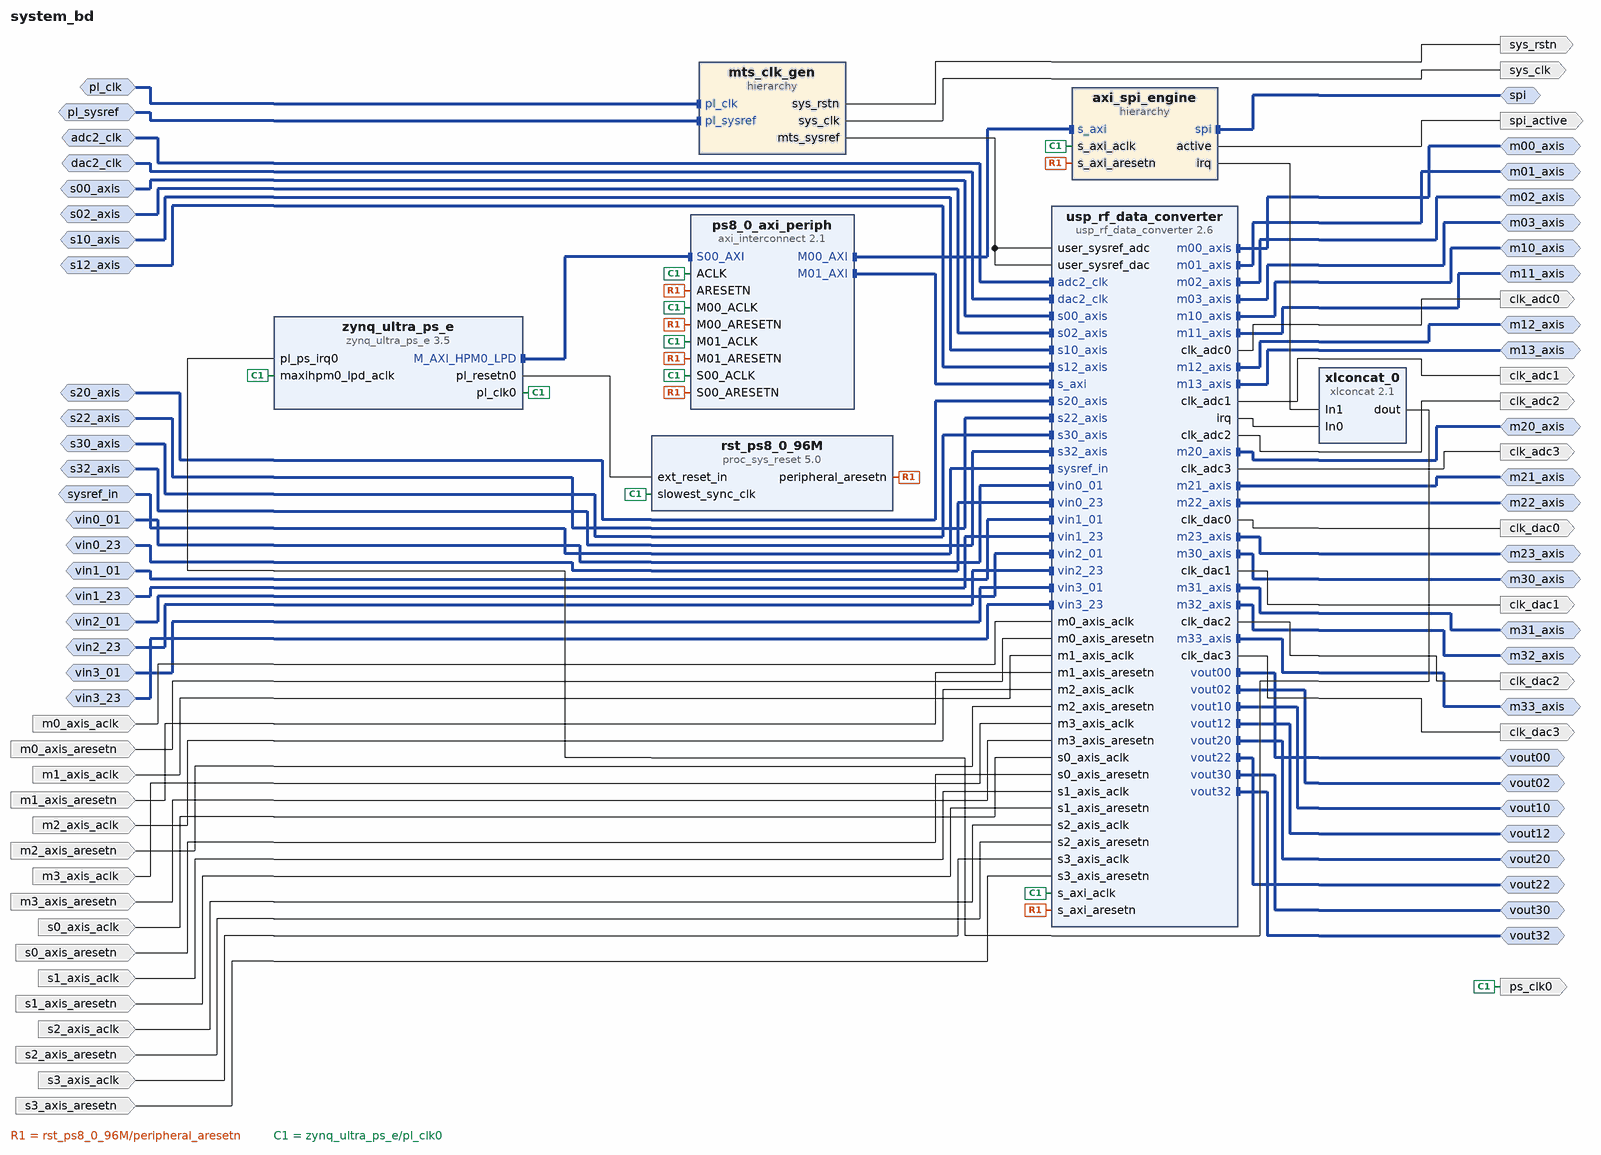
[diagram p0: block diagram of the top level]
# Vivado block design system_bd, xczu47dr-ffve1156-2-i, Vivado 2024.1
create_bd_design system_bd

create_bd_intf_port -mode Master -vlnv analog.com:interface:spi_engine_rtl:1.0 spi
create_bd_intf_port -mode Slave -vlnv xilinx.com:interface:diff_clock_rtl:1.0 pl_clk
set_property -dict {CONFIG.FREQ_HZ 245760000} [get_bd_intf_ports pl_clk]
create_bd_intf_port -mode Slave -vlnv xilinx.com:interface:diff_clock_rtl:1.0 pl_sysref
create_bd_intf_port -mode Slave -vlnv xilinx.com:interface:diff_clock_rtl:1.0 adc2_clk
create_bd_intf_port -mode Slave -vlnv xilinx.com:interface:diff_clock_rtl:1.0 dac2_clk
create_bd_intf_port -mode Master -vlnv xilinx.com:interface:axis_rtl:1.0 m00_axis
create_bd_intf_port -mode Master -vlnv xilinx.com:interface:axis_rtl:1.0 m01_axis
create_bd_intf_port -mode Master -vlnv xilinx.com:interface:axis_rtl:1.0 m02_axis
create_bd_intf_port -mode Master -vlnv xilinx.com:interface:axis_rtl:1.0 m03_axis
create_bd_intf_port -mode Master -vlnv xilinx.com:interface:axis_rtl:1.0 m10_axis
create_bd_intf_port -mode Master -vlnv xilinx.com:interface:axis_rtl:1.0 m11_axis
create_bd_intf_port -mode Master -vlnv xilinx.com:interface:axis_rtl:1.0 m12_axis
create_bd_intf_port -mode Master -vlnv xilinx.com:interface:axis_rtl:1.0 m13_axis
create_bd_intf_port -mode Master -vlnv xilinx.com:interface:axis_rtl:1.0 m20_axis
create_bd_intf_port -mode Master -vlnv xilinx.com:interface:axis_rtl:1.0 m21_axis
create_bd_intf_port -mode Master -vlnv xilinx.com:interface:axis_rtl:1.0 m22_axis
create_bd_intf_port -mode Master -vlnv xilinx.com:interface:axis_rtl:1.0 m23_axis
create_bd_intf_port -mode Master -vlnv xilinx.com:interface:axis_rtl:1.0 m30_axis
create_bd_intf_port -mode Master -vlnv xilinx.com:interface:axis_rtl:1.0 m31_axis
create_bd_intf_port -mode Master -vlnv xilinx.com:interface:axis_rtl:1.0 m32_axis
create_bd_intf_port -mode Master -vlnv xilinx.com:interface:axis_rtl:1.0 m33_axis
create_bd_intf_port -mode Slave -vlnv xilinx.com:interface:axis_rtl:1.0 s00_axis
set_property -dict [list \
  CONFIG.HAS_TKEEP 0 \
  CONFIG.HAS_TLAST 0 \
  CONFIG.HAS_TREADY 1 \
  CONFIG.HAS_TSTRB 0 \
  CONFIG.LAYERED_METADATA undef \
  CONFIG.TDATA_NUM_BYTES 4 \
  CONFIG.TDEST_WIDTH 0 \
  CONFIG.TID_WIDTH 0 \
  CONFIG.TUSER_WIDTH 0 \
] [get_bd_intf_ports s00_axis]
create_bd_intf_port -mode Slave -vlnv xilinx.com:interface:axis_rtl:1.0 s02_axis
set_property -dict [list \
  CONFIG.HAS_TKEEP 0 \
  CONFIG.HAS_TLAST 0 \
  CONFIG.HAS_TREADY 1 \
  CONFIG.HAS_TSTRB 0 \
  CONFIG.LAYERED_METADATA undef \
  CONFIG.TDATA_NUM_BYTES 4 \
  CONFIG.TDEST_WIDTH 0 \
  CONFIG.TID_WIDTH 0 \
  CONFIG.TUSER_WIDTH 0 \
] [get_bd_intf_ports s02_axis]
create_bd_intf_port -mode Slave -vlnv xilinx.com:interface:axis_rtl:1.0 s10_axis
set_property -dict [list \
  CONFIG.HAS_TKEEP 0 \
  CONFIG.HAS_TLAST 0 \
  CONFIG.HAS_TREADY 1 \
  CONFIG.HAS_TSTRB 0 \
  CONFIG.LAYERED_METADATA undef \
  CONFIG.TDATA_NUM_BYTES 4 \
  CONFIG.TDEST_WIDTH 0 \
  CONFIG.TID_WIDTH 0 \
  CONFIG.TUSER_WIDTH 0 \
] [get_bd_intf_ports s10_axis]
create_bd_intf_port -mode Slave -vlnv xilinx.com:interface:axis_rtl:1.0 s12_axis
set_property -dict [list \
  CONFIG.HAS_TKEEP 0 \
  CONFIG.HAS_TLAST 0 \
  CONFIG.HAS_TREADY 1 \
  CONFIG.HAS_TSTRB 0 \
  CONFIG.LAYERED_METADATA undef \
  CONFIG.TDATA_NUM_BYTES 4 \
  CONFIG.TDEST_WIDTH 0 \
  CONFIG.TID_WIDTH 0 \
  CONFIG.TUSER_WIDTH 0 \
] [get_bd_intf_ports s12_axis]
create_bd_intf_port -mode Slave -vlnv xilinx.com:interface:axis_rtl:1.0 s20_axis
set_property -dict [list \
  CONFIG.HAS_TKEEP 0 \
  CONFIG.HAS_TLAST 0 \
  CONFIG.HAS_TREADY 1 \
  CONFIG.HAS_TSTRB 0 \
  CONFIG.LAYERED_METADATA undef \
  CONFIG.TDATA_NUM_BYTES 4 \
  CONFIG.TDEST_WIDTH 0 \
  CONFIG.TID_WIDTH 0 \
  CONFIG.TUSER_WIDTH 0 \
] [get_bd_intf_ports s20_axis]
create_bd_intf_port -mode Slave -vlnv xilinx.com:interface:axis_rtl:1.0 s22_axis
set_property -dict [list \
  CONFIG.HAS_TKEEP 0 \
  CONFIG.HAS_TLAST 0 \
  CONFIG.HAS_TREADY 1 \
  CONFIG.HAS_TSTRB 0 \
  CONFIG.LAYERED_METADATA undef \
  CONFIG.TDATA_NUM_BYTES 4 \
  CONFIG.TDEST_WIDTH 0 \
  CONFIG.TID_WIDTH 0 \
  CONFIG.TUSER_WIDTH 0 \
] [get_bd_intf_ports s22_axis]
create_bd_intf_port -mode Slave -vlnv xilinx.com:interface:axis_rtl:1.0 s30_axis
set_property -dict [list \
  CONFIG.HAS_TKEEP 0 \
  CONFIG.HAS_TLAST 0 \
  CONFIG.HAS_TREADY 1 \
  CONFIG.HAS_TSTRB 0 \
  CONFIG.LAYERED_METADATA undef \
  CONFIG.TDATA_NUM_BYTES 4 \
  CONFIG.TDEST_WIDTH 0 \
  CONFIG.TID_WIDTH 0 \
  CONFIG.TUSER_WIDTH 0 \
] [get_bd_intf_ports s30_axis]
create_bd_intf_port -mode Slave -vlnv xilinx.com:interface:axis_rtl:1.0 s32_axis
set_property -dict [list \
  CONFIG.HAS_TKEEP 0 \
  CONFIG.HAS_TLAST 0 \
  CONFIG.HAS_TREADY 1 \
  CONFIG.HAS_TSTRB 0 \
  CONFIG.LAYERED_METADATA undef \
  CONFIG.TDATA_NUM_BYTES 4 \
  CONFIG.TDEST_WIDTH 0 \
  CONFIG.TID_WIDTH 0 \
  CONFIG.TUSER_WIDTH 0 \
] [get_bd_intf_ports s32_axis]
create_bd_intf_port -mode Slave -vlnv xilinx.com:display_usp_rf_data_converter:diff_pins_rtl:1.0 sysref_in
create_bd_intf_port -mode Slave -vlnv xilinx.com:interface:diff_analog_io_rtl:1.0 vin0_01
create_bd_intf_port -mode Slave -vlnv xilinx.com:interface:diff_analog_io_rtl:1.0 vin0_23
create_bd_intf_port -mode Slave -vlnv xilinx.com:interface:diff_analog_io_rtl:1.0 vin1_01
create_bd_intf_port -mode Slave -vlnv xilinx.com:interface:diff_analog_io_rtl:1.0 vin1_23
create_bd_intf_port -mode Slave -vlnv xilinx.com:interface:diff_analog_io_rtl:1.0 vin2_01
create_bd_intf_port -mode Slave -vlnv xilinx.com:interface:diff_analog_io_rtl:1.0 vin2_23
create_bd_intf_port -mode Slave -vlnv xilinx.com:interface:diff_analog_io_rtl:1.0 vin3_01
create_bd_intf_port -mode Slave -vlnv xilinx.com:interface:diff_analog_io_rtl:1.0 vin3_23
create_bd_intf_port -mode Master -vlnv xilinx.com:interface:diff_analog_io_rtl:1.0 vout00
create_bd_intf_port -mode Master -vlnv xilinx.com:interface:diff_analog_io_rtl:1.0 vout02
create_bd_intf_port -mode Master -vlnv xilinx.com:interface:diff_analog_io_rtl:1.0 vout10
create_bd_intf_port -mode Master -vlnv xilinx.com:interface:diff_analog_io_rtl:1.0 vout12
create_bd_intf_port -mode Master -vlnv xilinx.com:interface:diff_analog_io_rtl:1.0 vout20
create_bd_intf_port -mode Master -vlnv xilinx.com:interface:diff_analog_io_rtl:1.0 vout22
create_bd_intf_port -mode Master -vlnv xilinx.com:interface:diff_analog_io_rtl:1.0 vout30
create_bd_intf_port -mode Master -vlnv xilinx.com:interface:diff_analog_io_rtl:1.0 vout32
create_bd_port -dir O spi_active
create_bd_port -dir O -type clk sys_rstn
create_bd_port -dir O sys_clk
create_bd_port -dir O -type clk ps_clk0
create_bd_port -dir O -type clk clk_adc0
create_bd_port -dir O -type clk clk_adc1
create_bd_port -dir O -type clk clk_adc2
create_bd_port -dir O -type clk clk_adc3
create_bd_port -dir O -type clk clk_dac0
create_bd_port -dir O -type clk clk_dac1
create_bd_port -dir O -type clk clk_dac2
create_bd_port -dir O -type clk clk_dac3
create_bd_port -dir I -type clk m0_axis_aclk
set_property -dict {CONFIG.ASSOCIATED_RESET m0_axis_aresetn} [get_bd_ports m0_axis_aclk]
create_bd_port -dir I -type rst m0_axis_aresetn
create_bd_port -dir I -type clk m1_axis_aclk
set_property -dict {CONFIG.ASSOCIATED_RESET m1_axis_aresetn} [get_bd_ports m1_axis_aclk]
create_bd_port -dir I -type rst m1_axis_aresetn
create_bd_port -dir I -type clk m2_axis_aclk
set_property -dict {CONFIG.ASSOCIATED_RESET m2_axis_aresetn} [get_bd_ports m2_axis_aclk]
create_bd_port -dir I -type rst m2_axis_aresetn
create_bd_port -dir I -type clk m3_axis_aclk
set_property -dict {CONFIG.ASSOCIATED_RESET m3_axis_aresetn} [get_bd_ports m3_axis_aclk]
create_bd_port -dir I -type rst m3_axis_aresetn
create_bd_port -dir I -type clk s0_axis_aclk
set_property -dict {CONFIG.ASSOCIATED_RESET s0_axis_aresetn} [get_bd_ports s0_axis_aclk]
create_bd_port -dir I -type rst s0_axis_aresetn
create_bd_port -dir I -type clk s1_axis_aclk
set_property -dict {CONFIG.ASSOCIATED_RESET s1_axis_aresetn} [get_bd_ports s1_axis_aclk]
create_bd_port -dir I -type rst s1_axis_aresetn
create_bd_port -dir I -type clk s2_axis_aclk
set_property -dict {CONFIG.ASSOCIATED_RESET s2_axis_aresetn} [get_bd_ports s2_axis_aclk]
create_bd_port -dir I -type rst s2_axis_aresetn
create_bd_port -dir I -type clk s3_axis_aclk
set_property -dict {CONFIG.ASSOCIATED_RESET s3_axis_aresetn} [get_bd_ports s3_axis_aclk]
create_bd_port -dir I -type rst s3_axis_aresetn

create_bd_cell -type ip -vlnv xilinx.com:ip:usp_rf_data_converter:2.6 usp_rf_data_converter
set_property -dict [list \
  CONFIG.ADC0_Clock_Source 2 \
  CONFIG.ADC0_Multi_Tile_Sync true \
  CONFIG.ADC0_PLL_Enable false \
  CONFIG.ADC0_Refclk_Freq 4915.200 \
  CONFIG.ADC0_Sampling_Rate 4.9152 \
  CONFIG.ADC1_Clock_Dist 0 \
  CONFIG.ADC1_Clock_Source 2 \
  CONFIG.ADC1_Multi_Tile_Sync true \
  CONFIG.ADC1_PLL_Enable false \
  CONFIG.ADC1_Refclk_Freq 4915.200 \
  CONFIG.ADC2_Clock_Dist 1 \
  CONFIG.ADC2_Clock_Source 2 \
  CONFIG.ADC2_Multi_Tile_Sync true \
  CONFIG.ADC2_PLL_Enable false \
  CONFIG.ADC2_Refclk_Freq 4915.200 \
  CONFIG.ADC3_Clock_Source 2 \
  CONFIG.ADC3_Multi_Tile_Sync true \
  CONFIG.ADC3_PLL_Enable false \
  CONFIG.ADC3_Refclk_Freq 4915.200 \
  CONFIG.ADC_Data_Type00 1 \
  CONFIG.ADC_Data_Type02 1 \
  CONFIG.ADC_Data_Type12 1 \
  CONFIG.ADC_Data_Type22 1 \
  CONFIG.ADC_Data_Type32 1 \
  CONFIG.ADC_Data_Width00 1 \
  CONFIG.ADC_Data_Width02 1 \
  CONFIG.ADC_Data_Width10 1 \
  CONFIG.ADC_Data_Width12 1 \
  CONFIG.ADC_Data_Width20 1 \
  CONFIG.ADC_Data_Width22 1 \
  CONFIG.ADC_Data_Width30 1 \
  CONFIG.ADC_Data_Width32 1 \
  CONFIG.ADC_Decimation_Mode00 20 \
  CONFIG.ADC_Decimation_Mode02 20 \
  CONFIG.ADC_Decimation_Mode10 20 \
  CONFIG.ADC_Decimation_Mode12 20 \
  CONFIG.ADC_Decimation_Mode20 20 \
  CONFIG.ADC_Decimation_Mode22 20 \
  CONFIG.ADC_Decimation_Mode30 20 \
  CONFIG.ADC_Decimation_Mode32 20 \
  CONFIG.ADC_Mixer_Type00 2 \
  CONFIG.ADC_Mixer_Type02 2 \
  CONFIG.ADC_Mixer_Type10 2 \
  CONFIG.ADC_Mixer_Type12 2 \
  CONFIG.ADC_Mixer_Type20 2 \
  CONFIG.ADC_Mixer_Type22 2 \
  CONFIG.ADC_Mixer_Type30 2 \
  CONFIG.ADC_Mixer_Type32 2 \
  CONFIG.ADC_Slice02_Enable true \
  CONFIG.ADC_Slice10_Enable true \
  CONFIG.ADC_Slice12_Enable true \
  CONFIG.ADC_Slice20_Enable true \
  CONFIG.ADC_Slice22_Enable true \
  CONFIG.ADC_Slice30_Enable true \
  CONFIG.ADC_Slice32_Enable true \
  CONFIG.DAC0_Clock_Dist 0 \
  CONFIG.DAC0_Clock_Source 6 \
  CONFIG.DAC0_Multi_Tile_Sync true \
  CONFIG.DAC0_PLL_Enable false \
  CONFIG.DAC0_Refclk_Freq 4915.200 \
  CONFIG.DAC1_Multi_Tile_Sync true \
  CONFIG.DAC1_PLL_Enable false \
  CONFIG.DAC1_Refclk_Freq 4915.200 \
  CONFIG.DAC2_Clock_Dist 1 \
  CONFIG.DAC2_Clock_Source 6 \
  CONFIG.DAC2_Multi_Tile_Sync true \
  CONFIG.DAC2_PLL_Enable false \
  CONFIG.DAC2_Refclk_Freq 4915.200 \
  CONFIG.DAC3_Multi_Tile_Sync true \
  CONFIG.DAC3_PLL_Enable false \
  CONFIG.DAC3_Refclk_Freq 4915.200 \
  CONFIG.DAC_Data_Width00 2 \
  CONFIG.DAC_Data_Width02 2 \
  CONFIG.DAC_Data_Width10 2 \
  CONFIG.DAC_Data_Width12 2 \
  CONFIG.DAC_Data_Width20 2 \
  CONFIG.DAC_Data_Width22 2 \
  CONFIG.DAC_Data_Width30 2 \
  CONFIG.DAC_Data_Width32 2 \
  CONFIG.DAC_Interpolation_Mode00 20 \
  CONFIG.DAC_Interpolation_Mode02 20 \
  CONFIG.DAC_Interpolation_Mode10 20 \
  CONFIG.DAC_Interpolation_Mode12 20 \
  CONFIG.DAC_Interpolation_Mode20 20 \
  CONFIG.DAC_Interpolation_Mode22 20 \
  CONFIG.DAC_Interpolation_Mode30 20 \
  CONFIG.DAC_Interpolation_Mode32 20 \
  CONFIG.DAC_Mixer_Type00 2 \
  CONFIG.DAC_Mixer_Type02 2 \
  CONFIG.DAC_Mixer_Type10 2 \
  CONFIG.DAC_Mixer_Type12 2 \
  CONFIG.DAC_Mixer_Type20 2 \
  CONFIG.DAC_Mixer_Type22 2 \
  CONFIG.DAC_Mixer_Type30 2 \
  CONFIG.DAC_Mixer_Type32 2 \
  CONFIG.DAC_Slice00_Enable true \
  CONFIG.DAC_Slice02_Enable true \
  CONFIG.DAC_Slice10_Enable true \
  CONFIG.DAC_Slice12_Enable true \
  CONFIG.DAC_Slice20_Enable true \
  CONFIG.DAC_Slice22_Enable true \
  CONFIG.DAC_Slice30_Enable true \
  CONFIG.DAC_Slice32_Enable true \
] [get_bd_cells usp_rf_data_converter]
create_bd_cell -type hier axi_spi_engine
create_bd_cell -type ip -vlnv xilinx.com:ip:axi_interconnect:2.1 ps8_0_axi_periph
set_property -dict {CONFIG.NUM_MI 2} [get_bd_cells ps8_0_axi_periph]
create_bd_cell -type ip -vlnv xilinx.com:ip:proc_sys_reset:5.0 rst_ps8_0_96M
create_bd_cell -type hier mts_clk_gen
create_bd_cell -type ip -vlnv xilinx.com:ip:xlconcat:2.1 xlconcat_0
create_bd_cell -type ip -vlnv xilinx.com:ip:zynq_ultra_ps_e:3.5 zynq_ultra_ps_e
set_property -dict [list \
  CONFIG.PSU_BANK_0_IO_STANDARD LVCMOS18 \
  CONFIG.PSU_BANK_1_IO_STANDARD LVCMOS18 \
  CONFIG.PSU_BANK_2_IO_STANDARD LVCMOS18 \
  CONFIG.PSU_BANK_3_IO_STANDARD LVCMOS18 \
  CONFIG.PSU_DYNAMIC_DDR_CONFIG_EN 1 \
  CONFIG.PSU__CRF_APB__DDR_CTRL__FREQMHZ 1067 \
  CONFIG.PSU__CSUPMU__PERIPHERAL__VALID 1 \
  CONFIG.PSU__DDRC__COMPONENTS UDIMM \
  CONFIG.PSU__DDRC__DEVICE_CAPACITY {8192 MBits} \
  CONFIG.PSU__DDRC__DRAM_WIDTH {16 Bits} \
  CONFIG.PSU__DDRC__SPEED_BIN DDR4_2400P \
  CONFIG.PSU__DDR_HIGH_ADDRESS_GUI_ENABLE 1 \
  CONFIG.PSU__DDR__INTERFACE__FREQMHZ 533.500 \
  CONFIG.PSU__ENET3__FIFO__ENABLE 0 \
  CONFIG.PSU__ENET3__GRP_MDIO__ENABLE 1 \
  CONFIG.PSU__ENET3__GRP_MDIO__IO {MIO 76 .. 77} \
  CONFIG.PSU__ENET3__PERIPHERAL__ENABLE 1 \
  CONFIG.PSU__ENET3__PERIPHERAL__IO {MIO 64 .. 75} \
  CONFIG.PSU__ENET3__PTP__ENABLE 0 \
  CONFIG.PSU__ENET3__TSU__ENABLE 0 \
  CONFIG.PSU__GEM3_COHERENCY 0 \
  CONFIG.PSU__GEM3_ROUTE_THROUGH_FPD 0 \
  CONFIG.PSU__GEM__TSU__ENABLE 0 \
  CONFIG.PSU__I2C0__PERIPHERAL__ENABLE 1 \
  CONFIG.PSU__I2C0__PERIPHERAL__IO {MIO 14 .. 15} \
  CONFIG.PSU__I2C1__PERIPHERAL__ENABLE 1 \
  CONFIG.PSU__I2C1__PERIPHERAL__IO {MIO 16 .. 17} \
  CONFIG.PSU__PMU_COHERENCY 0 \
  CONFIG.PSU__PMU__AIBACK__ENABLE 0 \
  CONFIG.PSU__PMU__EMIO_GPI__ENABLE 0 \
  CONFIG.PSU__PMU__EMIO_GPO__ENABLE 0 \
  CONFIG.PSU__PMU__GPI0__ENABLE 1 \
  CONFIG.PSU__PMU__GPI0__IO {MIO 26} \
  CONFIG.PSU__PMU__GPI1__ENABLE 0 \
  CONFIG.PSU__PMU__GPI2__ENABLE 0 \
  CONFIG.PSU__PMU__GPI3__ENABLE 0 \
  CONFIG.PSU__PMU__GPI4__ENABLE 0 \
  CONFIG.PSU__PMU__GPI5__ENABLE 0 \
  CONFIG.PSU__PMU__GPO0__ENABLE 0 \
  CONFIG.PSU__PMU__GPO1__ENABLE 0 \
  CONFIG.PSU__PMU__GPO2__ENABLE 0 \
  CONFIG.PSU__PMU__GPO3__ENABLE 0 \
  CONFIG.PSU__PMU__GPO4__ENABLE 0 \
  CONFIG.PSU__PMU__GPO5__ENABLE 0 \
  CONFIG.PSU__PMU__PERIPHERAL__ENABLE 1 \
  CONFIG.PSU__PMU__PLERROR__ENABLE 0 \
  CONFIG.PSU__QSPI_COHERENCY 0 \
  CONFIG.PSU__QSPI_ROUTE_THROUGH_FPD 0 \
  CONFIG.PSU__QSPI__GRP_FBCLK__ENABLE 0 \
  CONFIG.PSU__QSPI__PERIPHERAL__DATA_MODE x4 \
  CONFIG.PSU__QSPI__PERIPHERAL__ENABLE 1 \
  CONFIG.PSU__QSPI__PERIPHERAL__IO {MIO 0 .. 12} \
  CONFIG.PSU__QSPI__PERIPHERAL__MODE {Dual Parallel} \
  CONFIG.PSU__TSU__BUFG_PORT_PAIR 0 \
  CONFIG.PSU__TTC0__CLOCK__ENABLE 0 \
  CONFIG.PSU__TTC0__PERIPHERAL__ENABLE 1 \
  CONFIG.PSU__TTC0__WAVEOUT__ENABLE 0 \
  CONFIG.PSU__TTC1__CLOCK__ENABLE 0 \
  CONFIG.PSU__TTC1__PERIPHERAL__ENABLE 1 \
  CONFIG.PSU__TTC1__WAVEOUT__ENABLE 0 \
  CONFIG.PSU__TTC2__CLOCK__ENABLE 0 \
  CONFIG.PSU__TTC2__PERIPHERAL__ENABLE 1 \
  CONFIG.PSU__TTC2__WAVEOUT__ENABLE 0 \
  CONFIG.PSU__TTC3__CLOCK__ENABLE 0 \
  CONFIG.PSU__TTC3__PERIPHERAL__ENABLE 1 \
  CONFIG.PSU__TTC3__WAVEOUT__ENABLE 0 \
  CONFIG.PSU__UART0__BAUD_RATE 115200 \
  CONFIG.PSU__UART0__MODEM__ENABLE 0 \
  CONFIG.PSU__UART0__PERIPHERAL__ENABLE 1 \
  CONFIG.PSU__UART0__PERIPHERAL__IO {MIO 18 .. 19} \
  CONFIG.PSU__USE__IRQ0 1 \
] [get_bd_cells zynq_ultra_ps_e]
# 57 more settings of zynq_ultra_ps_e are not shown: defaults, MIO pin electricals, DDR timing, and values the tool derives

# ---- hierarchy /axi_spi_engine ----
current_bd_instance /axi_spi_engine
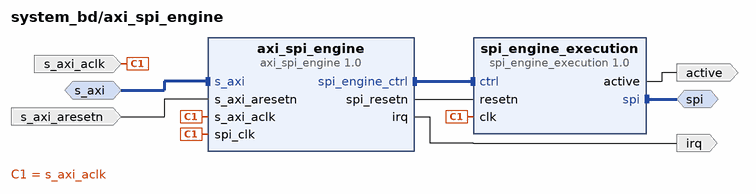
[diagram p1: block diagram inside /axi_spi_engine]
create_bd_intf_pin -mode Slave -vlnv xilinx.com:interface:aximm_rtl:1.0 s_axi
create_bd_intf_pin -mode Master -vlnv analog.com:interface:spi_engine_rtl:1.0 spi
create_bd_pin -dir I -type clk s_axi_aclk
create_bd_pin -dir I -type rst s_axi_aresetn
create_bd_pin -dir O active
create_bd_pin -dir O irq

create_bd_cell -type ip -vlnv analog.com:user:axi_spi_engine:1.0 axi_spi_engine
set_property -dict {CONFIG.NUM_OF_SDI 1} [get_bd_cells axi_spi_engine]
create_bd_cell -type ip -vlnv analog.com:user:spi_engine_execution:1.0 spi_engine_execution
set_property -dict {CONFIG.NUM_OF_CS 3 CONFIG.NUM_OF_SDI 1} [get_bd_cells spi_engine_execution]

# ---- hierarchy /mts_clk_gen ----
current_bd_instance /mts_clk_gen
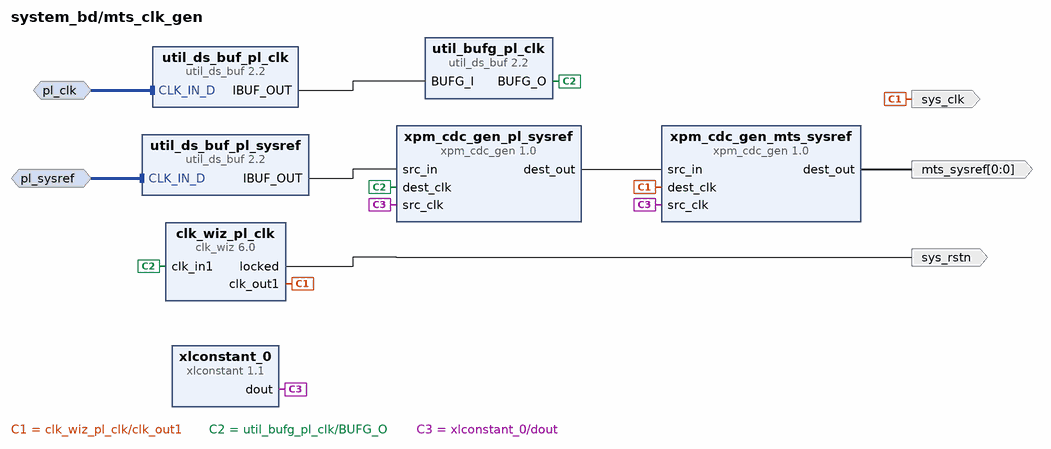
[diagram p2: block diagram inside /mts_clk_gen]
create_bd_intf_pin -mode Slave -vlnv xilinx.com:interface:diff_clock_rtl:1.0 pl_clk
create_bd_intf_pin -mode Slave -vlnv xilinx.com:interface:diff_clock_rtl:1.0 pl_sysref
create_bd_pin -dir O -from 0 -to 0 mts_sysref
create_bd_pin -dir O -type clk sys_rstn
create_bd_pin -dir O sys_clk

create_bd_cell -type ip -vlnv xilinx.com:ip:util_ds_buf:2.2 util_ds_buf_pl_clk
create_bd_cell -type ip -vlnv xilinx.com:ip:util_ds_buf:2.2 util_bufg_pl_clk
set_property -dict {CONFIG.C_BUF_TYPE BUFG} [get_bd_cells util_bufg_pl_clk]
create_bd_cell -type ip -vlnv xilinx.com:ip:util_ds_buf:2.2 util_ds_buf_pl_sysref
create_bd_cell -type ip -vlnv xilinx.com:ip:clk_wiz:6.0 clk_wiz_pl_clk
set_property -dict [list \
  CONFIG.CLKIN1_JITTER_PS 40.69 \
  CONFIG.CLKOUT1_JITTER 85.228 \
  CONFIG.CLKOUT1_PHASE_ERROR 77.902 \
  CONFIG.CLKOUT1_REQUESTED_OUT_FREQ 245.76 \
  CONFIG.MMCM_CLKFBOUT_MULT_F 4.875 \
  CONFIG.MMCM_CLKIN1_PERIOD 4.069 \
  CONFIG.MMCM_CLKIN2_PERIOD 10.0 \
  CONFIG.MMCM_CLKOUT0_DIVIDE_F 4.875 \
  CONFIG.MMCM_DIVCLK_DIVIDE 1 \
  CONFIG.OPTIMIZE_CLOCKING_STRUCTURE_EN true \
  CONFIG.PRIM_IN_FREQ 245.76 \
  CONFIG.USE_RESET false \
] [get_bd_cells clk_wiz_pl_clk]
create_bd_cell -type ip -vlnv xilinx.com:ip:xpm_cdc_gen:1.0 xpm_cdc_gen_pl_sysref
set_property -dict [list \
  CONFIG.CDC_TYPE xpm_cdc_single \
  CONFIG.DEST_SYNC_FF 2 \
  CONFIG.SIM_ASSERT_CHK false \
  CONFIG.SRC_INPUT_REG false \
] [get_bd_cells xpm_cdc_gen_pl_sysref]
create_bd_cell -type ip -vlnv xilinx.com:ip:xpm_cdc_gen:1.0 xpm_cdc_gen_mts_sysref
set_property -dict [list \
  CONFIG.CDC_TYPE xpm_cdc_single \
  CONFIG.DEST_SYNC_FF 2 \
  CONFIG.SIM_ASSERT_CHK false \
  CONFIG.SRC_INPUT_REG false \
] [get_bd_cells xpm_cdc_gen_mts_sysref]
create_bd_cell -type ip -vlnv xilinx.com:ip:xlconstant:1.1 xlconstant_0
set_property -dict {CONFIG.CONST_VAL 0} [get_bd_cells xlconstant_0]

# ---- connections ----

current_bd_instance /axi_spi_engine
connect_bd_intf_net [get_bd_intf_pins axi_spi_engine/s_axi] [get_bd_intf_pins s_axi]
connect_bd_intf_net [get_bd_intf_pins spi_engine_execution/spi] [get_bd_intf_pins spi]
connect_bd_intf_net [get_bd_intf_pins axi_spi_engine/spi_engine_ctrl] [get_bd_intf_pins spi_engine_execution/ctrl]
connect_bd_net [get_bd_pins axi_spi_engine/irq] [get_bd_pins irq]
connect_bd_net [get_bd_pins axi_spi_engine/spi_resetn] [get_bd_pins spi_engine_execution/resetn]
connect_bd_net -net s_axi_aclk_0_1 [get_bd_pins s_axi_aclk] \
  [get_bd_pins axi_spi_engine/s_axi_aclk] [get_bd_pins axi_spi_engine/spi_clk] [get_bd_pins spi_engine_execution/clk]
connect_bd_net [get_bd_pins s_axi_aresetn] [get_bd_pins axi_spi_engine/s_axi_aresetn]
connect_bd_net [get_bd_pins spi_engine_execution/active] [get_bd_pins active]

current_bd_instance /mts_clk_gen
connect_bd_intf_net [get_bd_intf_pins util_ds_buf_pl_clk/CLK_IN_D] [get_bd_intf_pins pl_clk]
connect_bd_intf_net [get_bd_intf_pins util_ds_buf_pl_sysref/CLK_IN_D] [get_bd_intf_pins pl_sysref]
connect_bd_net [get_bd_pins clk_wiz_pl_clk/clk_out1] [get_bd_pins sys_clk] [get_bd_pins xpm_cdc_gen_mts_sysref/dest_clk]
connect_bd_net [get_bd_pins clk_wiz_pl_clk/locked] [get_bd_pins sys_rstn]
connect_bd_net [get_bd_pins util_bufg_pl_clk/BUFG_O] [get_bd_pins clk_wiz_pl_clk/clk_in1] [get_bd_pins xpm_cdc_gen_pl_sysref/dest_clk]
connect_bd_net [get_bd_pins util_ds_buf_pl_clk/IBUF_OUT] [get_bd_pins util_bufg_pl_clk/BUFG_I]
connect_bd_net [get_bd_pins util_ds_buf_pl_sysref/IBUF_OUT] [get_bd_pins xpm_cdc_gen_pl_sysref/src_in]
connect_bd_net [get_bd_pins xlconstant_0/dout] [get_bd_pins xpm_cdc_gen_pl_sysref/src_clk] [get_bd_pins xpm_cdc_gen_mts_sysref/src_clk]
connect_bd_net [get_bd_pins xpm_cdc_gen_mts_sysref/dest_out] [get_bd_pins mts_sysref]
connect_bd_net [get_bd_pins xpm_cdc_gen_pl_sysref/dest_out] [get_bd_pins xpm_cdc_gen_mts_sysref/src_in]

current_bd_instance /
connect_bd_intf_net [get_bd_intf_ports adc2_clk] [get_bd_intf_pins usp_rf_data_converter/adc2_clk]
connect_bd_intf_net -intf_net adi_spi_engine_spi_0 [get_bd_intf_ports spi] [get_bd_intf_pins axi_spi_engine/spi]
connect_bd_intf_net [get_bd_intf_ports dac2_clk] [get_bd_intf_pins usp_rf_data_converter/dac2_clk]
connect_bd_intf_net -intf_net pl_clk_0_1 [get_bd_intf_ports pl_clk] [get_bd_intf_pins mts_clk_gen/pl_clk]
connect_bd_intf_net -intf_net pl_sysref_0_1 [get_bd_intf_ports pl_sysref] [get_bd_intf_pins mts_clk_gen/pl_sysref]
connect_bd_intf_net [get_bd_intf_pins ps8_0_axi_periph/M00_AXI] [get_bd_intf_pins axi_spi_engine/s_axi]
connect_bd_intf_net [get_bd_intf_pins ps8_0_axi_periph/M01_AXI] [get_bd_intf_pins usp_rf_data_converter/s_axi]
connect_bd_intf_net -intf_net s00_axis_0_1 [get_bd_intf_ports s00_axis] [get_bd_intf_pins usp_rf_data_converter/s00_axis]
connect_bd_intf_net -intf_net s02_axis_0_1 [get_bd_intf_ports s02_axis] [get_bd_intf_pins usp_rf_data_converter/s02_axis]
connect_bd_intf_net -intf_net s10_axis_0_1 [get_bd_intf_ports s10_axis] [get_bd_intf_pins usp_rf_data_converter/s10_axis]
connect_bd_intf_net -intf_net s12_axis_0_1 [get_bd_intf_ports s12_axis] [get_bd_intf_pins usp_rf_data_converter/s12_axis]
connect_bd_intf_net -intf_net s20_axis_0_1 [get_bd_intf_ports s20_axis] [get_bd_intf_pins usp_rf_data_converter/s20_axis]
connect_bd_intf_net -intf_net s22_axis_0_1 [get_bd_intf_ports s22_axis] [get_bd_intf_pins usp_rf_data_converter/s22_axis]
connect_bd_intf_net -intf_net s30_axis_0_1 [get_bd_intf_ports s30_axis] [get_bd_intf_pins usp_rf_data_converter/s30_axis]
connect_bd_intf_net -intf_net s32_axis_0_1 [get_bd_intf_ports s32_axis] [get_bd_intf_pins usp_rf_data_converter/s32_axis]
connect_bd_intf_net -intf_net sysref_in_0_1 [get_bd_intf_ports sysref_in] [get_bd_intf_pins usp_rf_data_converter/sysref_in]
connect_bd_intf_net [get_bd_intf_ports m00_axis] [get_bd_intf_pins usp_rf_data_converter/m00_axis]
connect_bd_intf_net [get_bd_intf_ports m01_axis] [get_bd_intf_pins usp_rf_data_converter/m01_axis]
connect_bd_intf_net [get_bd_intf_ports m02_axis] [get_bd_intf_pins usp_rf_data_converter/m02_axis]
connect_bd_intf_net [get_bd_intf_ports m03_axis] [get_bd_intf_pins usp_rf_data_converter/m03_axis]
connect_bd_intf_net [get_bd_intf_ports m10_axis] [get_bd_intf_pins usp_rf_data_converter/m10_axis]
connect_bd_intf_net [get_bd_intf_ports m11_axis] [get_bd_intf_pins usp_rf_data_converter/m11_axis]
connect_bd_intf_net [get_bd_intf_ports m12_axis] [get_bd_intf_pins usp_rf_data_converter/m12_axis]
connect_bd_intf_net [get_bd_intf_ports m13_axis] [get_bd_intf_pins usp_rf_data_converter/m13_axis]
connect_bd_intf_net [get_bd_intf_ports m20_axis] [get_bd_intf_pins usp_rf_data_converter/m20_axis]
connect_bd_intf_net [get_bd_intf_ports m21_axis] [get_bd_intf_pins usp_rf_data_converter/m21_axis]
connect_bd_intf_net [get_bd_intf_ports m22_axis] [get_bd_intf_pins usp_rf_data_converter/m22_axis]
connect_bd_intf_net [get_bd_intf_ports m23_axis] [get_bd_intf_pins usp_rf_data_converter/m23_axis]
connect_bd_intf_net [get_bd_intf_ports m30_axis] [get_bd_intf_pins usp_rf_data_converter/m30_axis]
connect_bd_intf_net [get_bd_intf_ports m31_axis] [get_bd_intf_pins usp_rf_data_converter/m31_axis]
connect_bd_intf_net [get_bd_intf_ports m32_axis] [get_bd_intf_pins usp_rf_data_converter/m32_axis]
connect_bd_intf_net [get_bd_intf_ports m33_axis] [get_bd_intf_pins usp_rf_data_converter/m33_axis]
connect_bd_intf_net [get_bd_intf_ports vout00] [get_bd_intf_pins usp_rf_data_converter/vout00]
connect_bd_intf_net [get_bd_intf_ports vout02] [get_bd_intf_pins usp_rf_data_converter/vout02]
connect_bd_intf_net [get_bd_intf_ports vout10] [get_bd_intf_pins usp_rf_data_converter/vout10]
connect_bd_intf_net [get_bd_intf_ports vout12] [get_bd_intf_pins usp_rf_data_converter/vout12]
connect_bd_intf_net [get_bd_intf_ports vout20] [get_bd_intf_pins usp_rf_data_converter/vout20]
connect_bd_intf_net [get_bd_intf_ports vout22] [get_bd_intf_pins usp_rf_data_converter/vout22]
connect_bd_intf_net [get_bd_intf_ports vout30] [get_bd_intf_pins usp_rf_data_converter/vout30]
connect_bd_intf_net [get_bd_intf_ports vout32] [get_bd_intf_pins usp_rf_data_converter/vout32]
connect_bd_intf_net -intf_net vin0_01_0_1 [get_bd_intf_ports vin0_01] [get_bd_intf_pins usp_rf_data_converter/vin0_01]
connect_bd_intf_net -intf_net vin0_23_0_1 [get_bd_intf_ports vin0_23] [get_bd_intf_pins usp_rf_data_converter/vin0_23]
connect_bd_intf_net -intf_net vin1_01_0_1 [get_bd_intf_ports vin1_01] [get_bd_intf_pins usp_rf_data_converter/vin1_01]
connect_bd_intf_net -intf_net vin1_23_0_1 [get_bd_intf_ports vin1_23] [get_bd_intf_pins usp_rf_data_converter/vin1_23]
connect_bd_intf_net -intf_net vin2_01_0_1 [get_bd_intf_ports vin2_01] [get_bd_intf_pins usp_rf_data_converter/vin2_01]
connect_bd_intf_net -intf_net vin2_23_0_1 [get_bd_intf_ports vin2_23] [get_bd_intf_pins usp_rf_data_converter/vin2_23]
connect_bd_intf_net -intf_net vin3_01_0_1 [get_bd_intf_ports vin3_01] [get_bd_intf_pins usp_rf_data_converter/vin3_01]
connect_bd_intf_net -intf_net vin3_23_0_1 [get_bd_intf_ports vin3_23] [get_bd_intf_pins usp_rf_data_converter/vin3_23]
connect_bd_intf_net [get_bd_intf_pins zynq_ultra_ps_e/M_AXI_HPM0_LPD] [get_bd_intf_pins ps8_0_axi_periph/S00_AXI]
connect_bd_net -net adi_spi_engine_active_0 [get_bd_pins axi_spi_engine/active] [get_bd_ports spi_active]
connect_bd_net -net adi_spi_engine_irq [get_bd_pins axi_spi_engine/irq] [get_bd_pins xlconcat_0/In1]
connect_bd_net -net m0_axis_aclk_0_1 [get_bd_ports m0_axis_aclk] [get_bd_pins usp_rf_data_converter/m0_axis_aclk]
connect_bd_net -net m0_axis_aresetn_0_1 [get_bd_ports m0_axis_aresetn] [get_bd_pins usp_rf_data_converter/m0_axis_aresetn]
connect_bd_net -net m1_axis_aclk_0_1 [get_bd_ports m1_axis_aclk] [get_bd_pins usp_rf_data_converter/m1_axis_aclk]
connect_bd_net -net m1_axis_aresetn_0_1 [get_bd_ports m1_axis_aresetn] [get_bd_pins usp_rf_data_converter/m1_axis_aresetn]
connect_bd_net -net m2_axis_aclk_0_1 [get_bd_ports m2_axis_aclk] [get_bd_pins usp_rf_data_converter/m2_axis_aclk]
connect_bd_net -net m2_axis_aresetn_0_1 [get_bd_ports m2_axis_aresetn] [get_bd_pins usp_rf_data_converter/m2_axis_aresetn]
connect_bd_net -net m3_axis_aclk_0_1 [get_bd_ports m3_axis_aclk] [get_bd_pins usp_rf_data_converter/m3_axis_aclk]
connect_bd_net -net m3_axis_aresetn_0_1 [get_bd_ports m3_axis_aresetn] [get_bd_pins usp_rf_data_converter/m3_axis_aresetn]
connect_bd_net -net mts_sysref_gen_clk_out1_0 [get_bd_pins mts_clk_gen/sys_rstn] [get_bd_ports sys_rstn]
connect_bd_net -net mts_sysref_gen_locked_0 [get_bd_pins mts_clk_gen/sys_clk] [get_bd_ports sys_clk]
connect_bd_net -net mts_sysref_gen_mts_sysref [get_bd_pins mts_clk_gen/mts_sysref] \
  [get_bd_pins usp_rf_data_converter/user_sysref_adc] [get_bd_pins usp_rf_data_converter/user_sysref_dac]
connect_bd_net [get_bd_pins rst_ps8_0_96M/peripheral_aresetn] \
  [get_bd_pins ps8_0_axi_periph/S00_ARESETN] [get_bd_pins axi_spi_engine/s_axi_aresetn] \
  [get_bd_pins ps8_0_axi_periph/M00_ARESETN] [get_bd_pins ps8_0_axi_periph/ARESETN] \
  [get_bd_pins usp_rf_data_converter/s_axi_aresetn] [get_bd_pins ps8_0_axi_periph/M01_ARESETN]
connect_bd_net -net s0_axis_aclk_0_1 [get_bd_ports s0_axis_aclk] [get_bd_pins usp_rf_data_converter/s0_axis_aclk]
connect_bd_net -net s0_axis_aresetn_0_1 [get_bd_ports s0_axis_aresetn] [get_bd_pins usp_rf_data_converter/s0_axis_aresetn]
connect_bd_net -net s1_axis_aclk_0_1 [get_bd_ports s1_axis_aclk] [get_bd_pins usp_rf_data_converter/s1_axis_aclk]
connect_bd_net -net s1_axis_aresetn_0_1 [get_bd_ports s1_axis_aresetn] [get_bd_pins usp_rf_data_converter/s1_axis_aresetn]
connect_bd_net -net s2_axis_aclk_0_1 [get_bd_ports s2_axis_aclk] [get_bd_pins usp_rf_data_converter/s2_axis_aclk]
connect_bd_net -net s2_axis_aresetn_0_1 [get_bd_ports s2_axis_aresetn] [get_bd_pins usp_rf_data_converter/s2_axis_aresetn]
connect_bd_net -net s3_axis_aclk_0_1 [get_bd_ports s3_axis_aclk] [get_bd_pins usp_rf_data_converter/s3_axis_aclk]
connect_bd_net -net s3_axis_aresetn_0_1 [get_bd_ports s3_axis_aresetn] [get_bd_pins usp_rf_data_converter/s3_axis_aresetn]
connect_bd_net [get_bd_pins usp_rf_data_converter/clk_adc0] [get_bd_ports clk_adc0]
connect_bd_net [get_bd_pins usp_rf_data_converter/clk_adc1] [get_bd_ports clk_adc1]
connect_bd_net [get_bd_pins usp_rf_data_converter/clk_adc2] [get_bd_ports clk_adc2]
connect_bd_net [get_bd_pins usp_rf_data_converter/clk_adc3] [get_bd_ports clk_adc3]
connect_bd_net [get_bd_pins usp_rf_data_converter/clk_dac0] [get_bd_ports clk_dac0]
connect_bd_net [get_bd_pins usp_rf_data_converter/clk_dac1] [get_bd_ports clk_dac1]
connect_bd_net [get_bd_pins usp_rf_data_converter/clk_dac2] [get_bd_ports clk_dac2]
connect_bd_net [get_bd_pins usp_rf_data_converter/clk_dac3] [get_bd_ports clk_dac3]
connect_bd_net [get_bd_pins usp_rf_data_converter/irq] [get_bd_pins xlconcat_0/In0]
connect_bd_net [get_bd_pins xlconcat_0/dout] [get_bd_pins zynq_ultra_ps_e/pl_ps_irq0]
connect_bd_net [get_bd_pins zynq_ultra_ps_e/pl_clk0] \
  [get_bd_ports ps_clk0] [get_bd_pins ps8_0_axi_periph/S00_ACLK] [get_bd_pins rst_ps8_0_96M/slowest_sync_clk] \
  [get_bd_pins axi_spi_engine/s_axi_aclk] [get_bd_pins ps8_0_axi_periph/M00_ACLK] [get_bd_pins ps8_0_axi_periph/ACLK] \
  [get_bd_pins usp_rf_data_converter/s_axi_aclk] [get_bd_pins ps8_0_axi_periph/M01_ACLK] \
  [get_bd_pins zynq_ultra_ps_e/maxihpm0_lpd_aclk]
connect_bd_net [get_bd_pins zynq_ultra_ps_e/pl_resetn0] [get_bd_pins rst_ps8_0_96M/ext_reset_in]

# ---- address map ----
assign_bd_address -offset 0x0080000000 -range 64K -target_address_space [get_bd_addr_spaces zynq_ultra_ps_e/Data] [get_bd_addr_segs axi_spi_engine/axi_spi_engine/s_axi/axi_lite]
assign_bd_address -offset 0x0080040000 -range 256K -target_address_space [get_bd_addr_spaces zynq_ultra_ps_e/Data] [get_bd_addr_segs usp_rf_data_converter/s_axi/Reg]

validate_bd_design
save_bd_design
